# Altium project PRJ_DualMode_RobotCar.PrjPcb
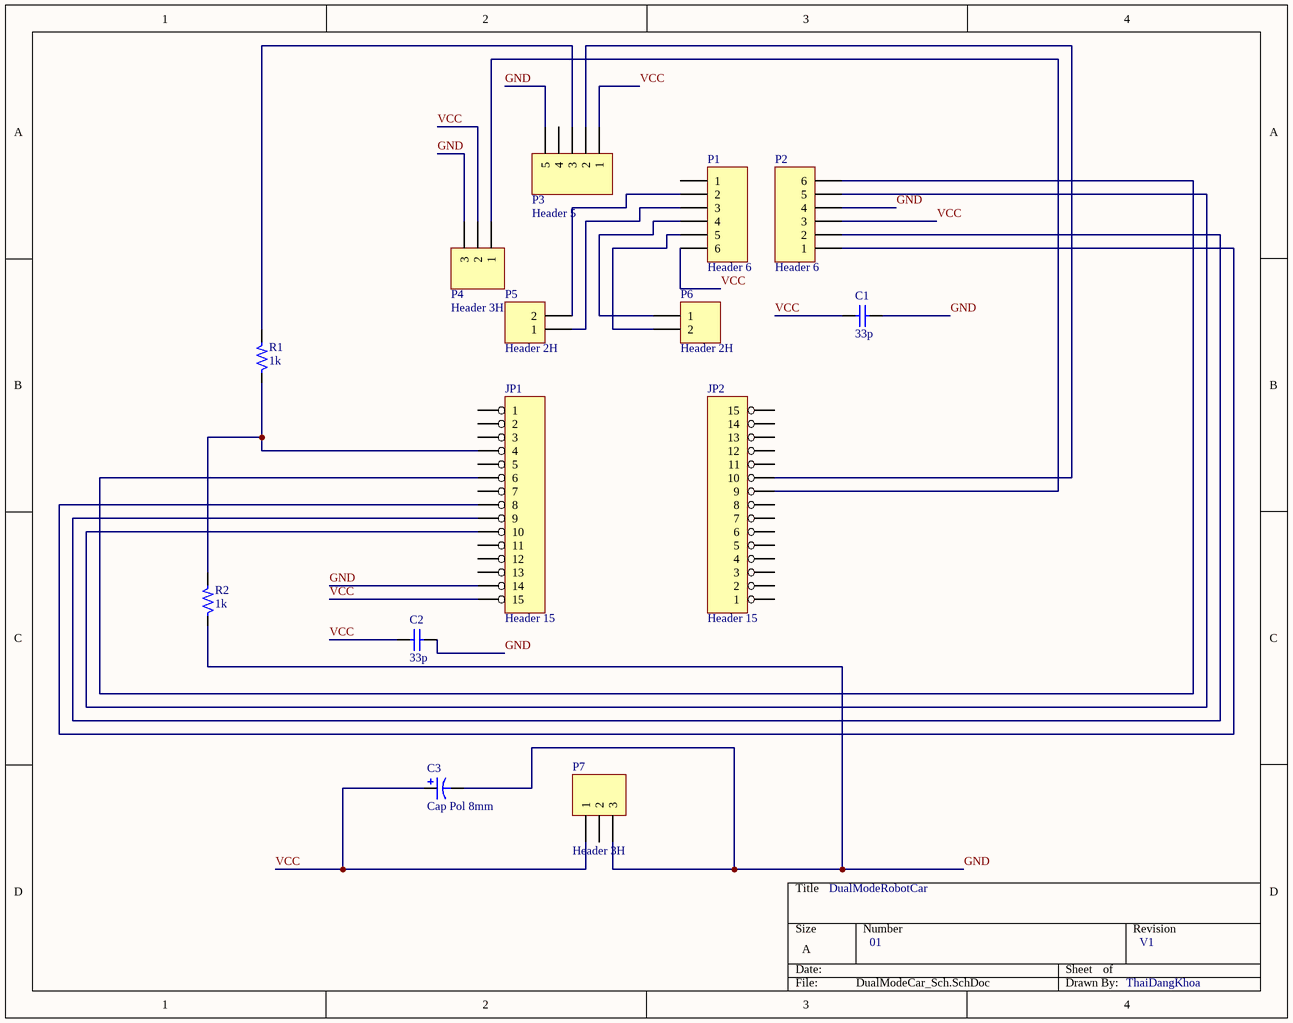
[diagram p0: DualModeCar_Sch.SchDoc]
1 sheet, 14 parts. Net scope: global (net labels, ports and power ports of the same name join across sheets).
Board file: PCB1_DualModeCar.PcbDoc

## Sheet DualModeCar_Sch.SchDoc: DualModeRobotCar
size A; Author: ThaiDangKhoa; DocumentNumber: 01; Revision: V1; SheetNumber: 1; SheetTotal: 1

### Parts
C1  value 33p  [Tu-pico]  (hidden comment: Capacitor Ceramic)
C2  value 33p  [Tu-pico]  (hidden comment: Capacitor Ceramic)
C3  Cap Pol 8mm  [C10mm]
JP1  Header 15  [HDR1X15]
JP2  Header 15  [HDR1X15]
P1  Header 6  [HDR1X6]
P2  Header 6  [HDR1X6]
P3  Header 5  [HDR1X5]
P4  Header 3H  [HDR1X3H]
P5  Header 2H  [HDR1X2H]
P6  Header 2H  [HDR1X2H]
P7  Header 3H  [HDR1X3H]
R1  1k  [RES 1/4W CFR25]
R2  1k  [RES 1/4W CFR25]

### Nets
GND: C1.2 C2.2 C3.2 JP1.14 P2.4 P3.5 P4.3 P7.3 R2.1
VCC: C1.1 C2.1 C3.1 JP1.15 P1.6 P2.3 P3.1 P4.2 P7.1
NetJP1_4: JP1.4 R1.1 R2.2
NetJP1_6: JP1.6 P2.6
NetJP1_8: JP1.8 P2.1
NetJP1_9: JP1.9 P2.2
NetJP1_10: JP1.10 P2.5
NetJP2_9: JP2.9 P4.1
NetJP2_10: JP2.10 P3.2
NetP1_2: P1.2 P5.2
NetP1_3: P1.3 P5.1
NetP1_4: P1.4 P6.1
NetP1_5: P1.5 P6.2
NetP3_3: P3.3 R1.2

Not connected (* = marked no-connect by the designer): JP1 1 2 3 5 7 11 12 13; JP2 1 2 3 4 5 6 7 8 11 12 13 14 15; P1 1; P3 4; P7 2

### Notes on the sheet
- ThaiDangKhoa

### Library data of the parts
C1 C2 = CapCeramic: Capacitor; Published: 8-Jun-2000; LatestRevisionDate: 17-Jul-2002; LatestRevisionNote: Re-released for DXP Platform.; PackageReference: RAD-0.3; Publisher: Altium Limited
C3 = Cap Pol 8mm: Polarized Capacitor (Axial); Published: 8-Jun-2000; LatestRevisionDate: 17-Jul-2002; LatestRevisionNote: Re-released for DXP Platform.; PackageReference: POLAR0.8; Publisher: Altium Limited
JP1 JP2 = Header 15: Header, 15-Pin, Right Angle
P1 P2 = Header 6: Header, 6-Pin; LatestRevisionDate: 17-Jul-2002; LatestRevisionNote: Re-released for DXP Platform.; Publisher: Altium Limited
P3 = Header 5: Header, 5-Pin; LatestRevisionDate: 17-Jul-2002; LatestRevisionNote: Re-released for DXP Platform.; Publisher: Altium Limited
P4 P7 = Header 3H: Header, 3-Pin, Right Angle; LatestRevisionDate: 17-Jul-2002; LatestRevisionNote: Re-released for DXP Platform.; Publisher: Altium Limited
P5 P6 = Header 2H: Header, 2-Pin, Right Angle; LatestRevisionDate: 17-Jul-2002; LatestRevisionNote: Re-released for DXP Platform.; Publisher: Altium Limited
R1 = Res: Resistor 1/4W; Value: R1/4W - 1K
R2 = Res: Resistor 1/4W; Value: R1/4W - 2K